# Altium schematic sheet adc_pi-dock.SchDoc
size Letter
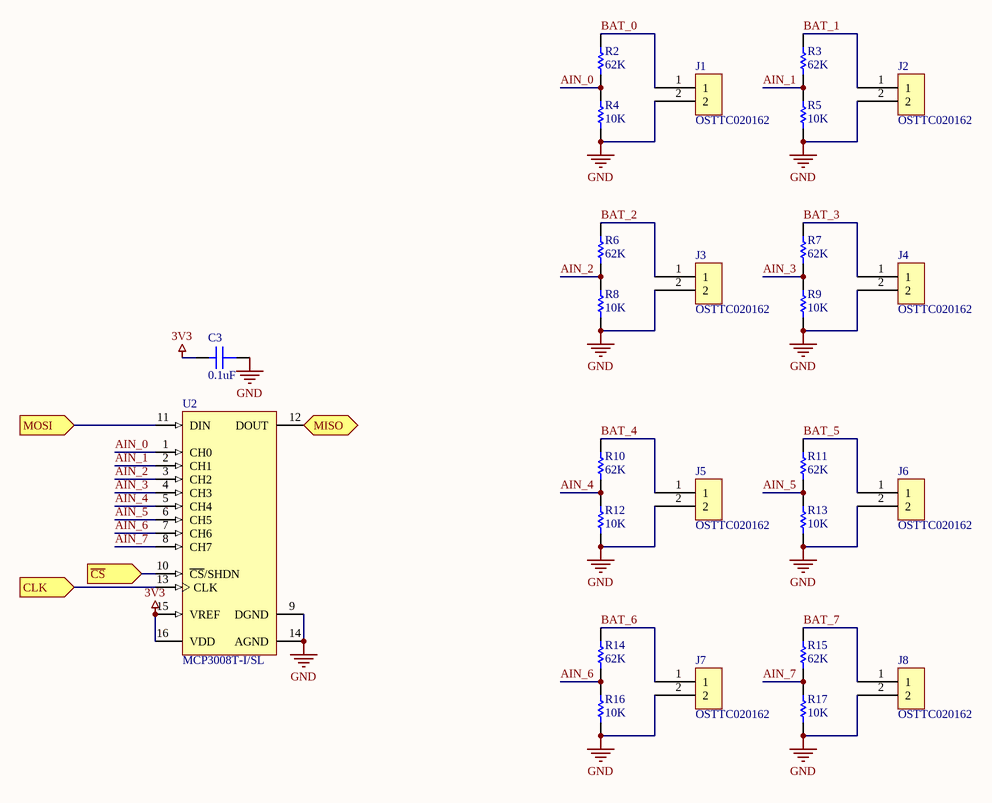
[diagram p0: adc_pi-dock.SchDoc]

## Parts
C3  0.1uF  [CAP_8085]
J1  OSTTC020162  [DIP2_5MM_SCREWTERM]
J2  OSTTC020162  [DIP2_5MM_SCREWTERM]
J3  OSTTC020162  [DIP2_5MM_SCREWTERM]
J4  OSTTC020162  [DIP2_5MM_SCREWTERM]
J5  OSTTC020162  [DIP2_5MM_SCREWTERM]
J6  OSTTC020162  [DIP2_5MM_SCREWTERM]
J7  OSTTC020162  [DIP2_5MM_SCREWTERM]
J8  OSTTC020162  [DIP2_5MM_SCREWTERM]
R2  62K  [RES_8085]
R3  62K  [RES_8085]
R4  10K  [RES_8085]
R5  10K  [RES_8085]
R6  62K  [RES_8085]
R7  62K  [RES_8085]
R8  10K  [RES_8085]
R9  10K  [RES_8085]
R10  62K  [RES_8085]
R11  62K  [RES_8085]
R12  10K  [RES_8085]
R13  10K  [RES_8085]
R14  62K  [RES_8085]
R15  62K  [RES_8085]
R16  10K  [RES_8085]
R17  10K  [RES_8085]
U2  MCP3008T-I/SL  [SOIC-SL16_N]

## Ports
CLK (in), MISO (out), MOSI (in), ~{CS} (in)

## Nets
3V3: C3.2 U2.15(VREF) U2.16(VDD)
GND: C3.1 J1.2 J2.2 J3.2 J4.2 J5.2 J6.2 J7.2 J8.2 R4.1 R5.1 R8.1 R9.1 R12.1 R13.1 R16.1 R17.1 U2.9(DGND) U2.14(AGND)
AIN_0: R2.1 R4.2 U2.1(CH0)
AIN_1: R3.1 R5.2 U2.2(CH1)
AIN_2: R6.1 R8.2 U2.3(CH2)
AIN_3: R7.1 R9.2 U2.4(CH3)
AIN_4: R10.1 R12.2 U2.5(CH4)
AIN_5: R11.1 R13.2 U2.6(CH5)
AIN_6: R14.1 R16.2 U2.7(CH6)
AIN_7: R15.1 R17.2 U2.8(CH7)
BAT_0: J1.1 R2.2
BAT_1: J2.1 R3.2
BAT_2: J3.1 R6.2
BAT_3: J4.1 R7.2
BAT_4: J5.1 R10.2
BAT_5: J6.1 R11.2
BAT_6: J7.1 R14.2
BAT_7: J8.1 R15.2
~{CS}: U2.10(~{CS}/SHDN) ; port ~{CS}
CLK: U2.13(CLK) ; port CLK
MISO: U2.12(DOUT) ; port MISO
MOSI: U2.11(DIN) ; port MOSI

## Library data of the parts
C3 = CHIP-CAP: SMD Chip Capacitor; Value: 0.1uF
J1-J8 = OSTTC020162: ON SHORE TERMINAL BLOCK 5MM VERT 2POS PCB; ComponentLink1URL: http://www.on-shore.com/sites/default/files/manuals/osttcxx0162.pdf; ComponentLink1Description: Datasheet; Supplier 1: Digi-Key; Supplier Part Number 1: ED2600-ND
R2-R17 = CHIP-RES: SMD Chip Resistor
  R2 R3 R6 R7 R10 R11 R14 R15: Value: 62K
  R4 R5 R8 R9 R12 R13 R16 R17: Value: 10K
U2 = CMP-0188-00351-2: 2.7V 4-Channel/8-Channel 10-Bit A/D Converters with SPI Serial Interface, 16-Pin SOIC 150mil, Industrial Temperature, Tape and Reel; ComponentLink2Description: Datasheet; Code_JEDEC: MS-012-AC; Code_IPC: SOIC127P600-16; ComponentLink1Description: Manufacturer URL; DatasheetVersion: revD, Dec-2008; PackageReference: SOIC-SL16; ComponentLink2URL: http://ww1.microchip.com/downloads/en/DeviceDoc/21295d.pdf; ComponentLink3Description: Package Specification; ComponentLink3URL: http://www.microchip.com/stellent/groups/techpub_sg/documents/packagingspec/en012702.pdf; PackageVersion: revBB, Aug-2009; RevisionNote: URLs added.; PackageDescription: 16-Lead Plastic Small Outline (SL) - Narrow, 3.90mm Body [SOIC]; ComponentLink1URL: http://www.microchip.com/